# Altium schematic sheet led1.SchDoc
size A4; DocumentNumber: 1; SheetNumber: 1; SheetTotal: 8
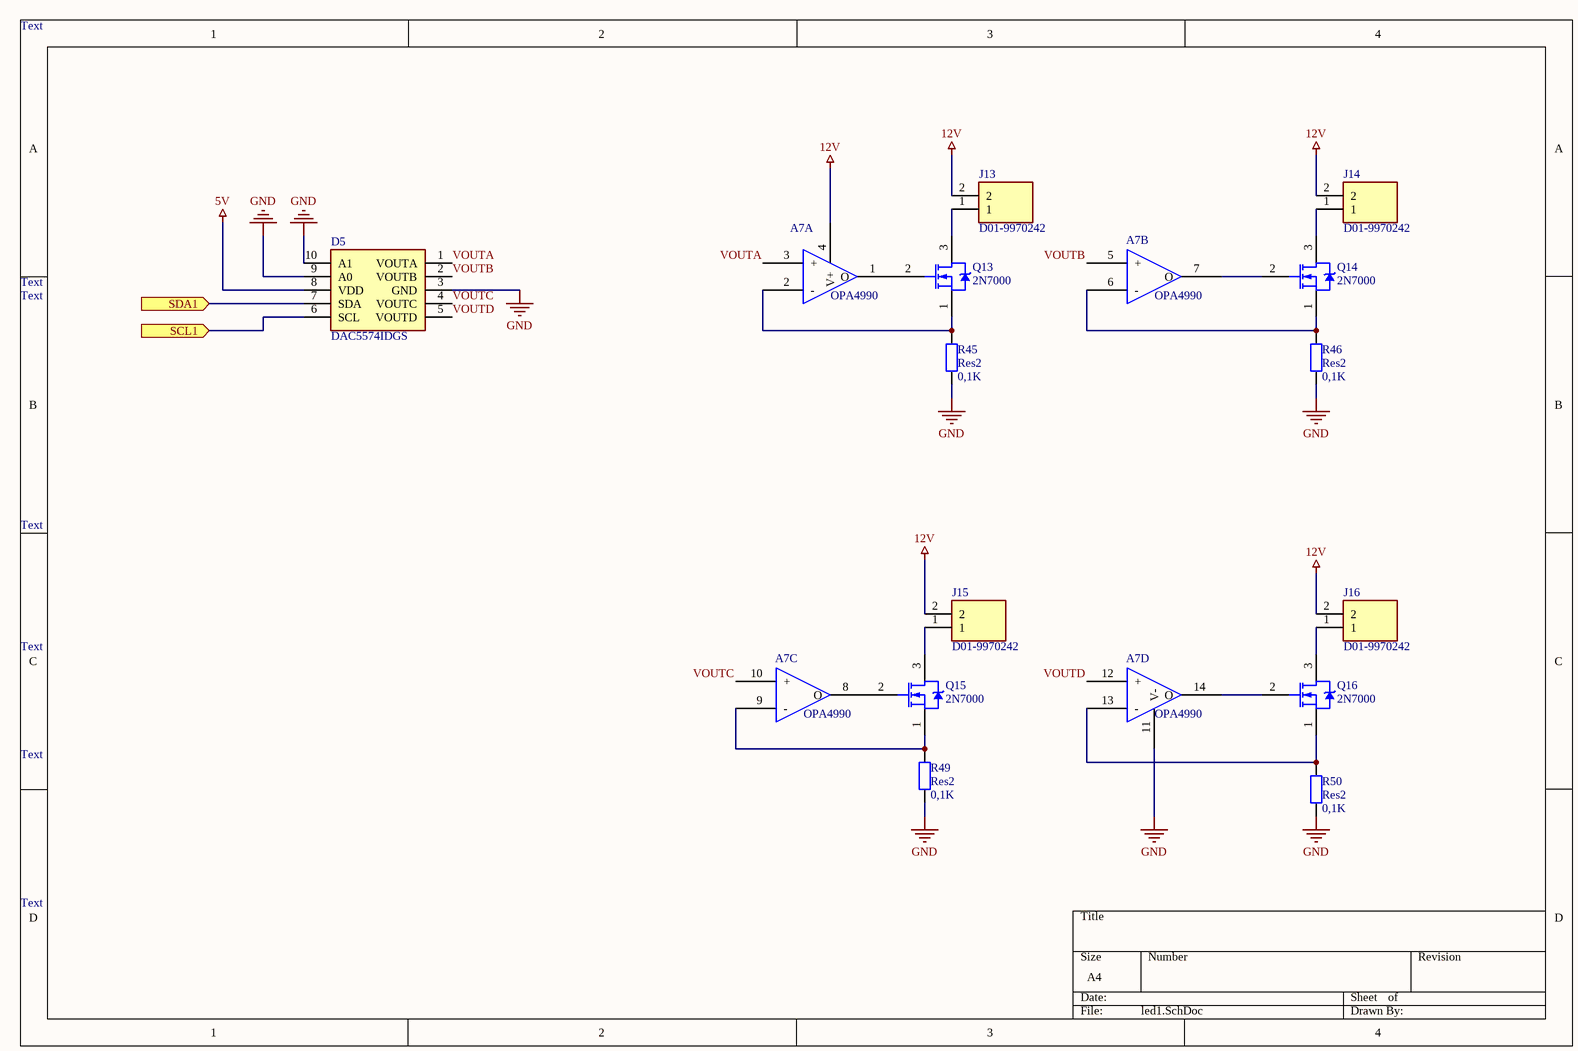
[diagram p0: led1.SchDoc]

## Parts
A7  OPA4990  [SOIC127P600X175-14N]  (parts A,B,C,D of 4)
D5  DAC5574IDGS  [SOP50P490X110-10N]
J13  D01-9970242  [HDR1X2]
J14  D01-9970242  [HDR1X2]
J15  D01-9970242  [HDR1X2]
J16  D01-9970242  [HDR1X2]
Q13  2N7000  [ONSC-TO-92-3-29-11]
Q14  2N7000  [ONSC-TO-92-3-29-11]
Q15  2N7000  [ONSC-TO-92-3-29-11]
Q16  2N7000  [ONSC-TO-92-3-29-11]
R45  Res2  value 0,1K  [C1210]
R46  Res2  value 0,1K  [C1210]
R49  Res2  value 0,1K  [C1210]
R50  Res2  value 0,1K  [C1210]

## Ports
SCL1 (in), SDA1 (in)

## Nets
5V: D5.8(VDD)
12V: A7.4(V+) J13.2 J14.2 J15.2 J16.2
GND: A7.11(V-) D5.3(GND) D5.9(A0) D5.10(A1) R45.1 R46.1 R49.2 R50.2
SCL1: D5.6(SCL) ; port SCL1
SDA1: D5.7(SDA) ; port SDA1
VOUTA: A7.3(+) D5.1(VOUTA)
VOUTB: A7.5(+) D5.2(VOUTB)
VOUTC: A7.10(+) D5.4(VOUTC)
VOUTD: A7.12(+) D5.5(VOUTD)
NetA7_1: A7.1(O) Q13.2(G)
NetA7_2: A7.2(-) Q13.1(S) R45.2
NetA7_6: A7.6(-) Q14.1(S) R46.2
NetA7_7: A7.7(O) Q14.2(G)
NetA7_8: A7.8(O) Q15.2(G)
NetA7_9: A7.9(-) Q15.1(S) R49.1
NetA7_13: A7.13(-) Q16.1(S) R50.1
NetA7_14: A7.14(O) Q16.2(G)
NetJ13_1: J13.1 Q13.3(D)
NetJ14_1: J14.1 Q14.3(D)
NetJ15_1: J15.1 Q15.3(D)
NetJ16_1: J16.1 Q16.3(D)

## Notes on the sheet
- Text

## Library data of the parts
D5 = DAC5574IDGS: Integrated Circuit; Manufacturer_Name: Texas Instruments; Datasheet Link: http://www.ti.com/lit/gpn/dac5574; Height: 1.1mm; Manufacturer_Part_Number: DAC5574IDGS; Mouser Part Number: 595-DAC5574IDGS; Mouser Price/Stock: https://www.mouser.com/Search/Refine.aspx?Keyword=595-DAC5574IDGS; RS Part Number: 6621533P; RS Price/Stock: http://uk.rs-online.com/web/p/products/6621533P
J13-J16 = D01-9970242: Connector; Manufacturer_Name: HARWIN; Datasheet Link: https://componentsearchengine.com/Datasheets/1/D01-9970242.pdf; Height: 4.25mm; Manufacturer_Part_Number: D01-9970242; Mouser Part Number: 855-D01-9970242; Mouser Price/Stock: https://www.mouser.com/Search/Refine.aspx?Keyword=855-D01-9970242
Q13-Q16 = CMP-1058-00936-1: Small Signal MOSFET, 200 mA, 60 V, N-Channel, 3-Pin TO-92, Bulk Box; Manufacturer: On Semiconductor; Ciss Typ (pF): 60; VGS(th) Max (V): 3; Crss Typ (pF): 5; Channel Polarity: N Channel; VGS Max (V): 20; Configuration: Single; PD Max (W): 0.35; Coss Typ (pF): 25; ID Max (A): 0.2; PackageVersion: Rev. AM; ComponentLink3URL: http://www.onsemi.cn/pub_link/Collateral/2N6426-D.PDF; ComponentLink2URL: http://www.onsemi.com/pub_link/Collateral/2N7000-D.PDF; DatasheetVersion: Rev. 8; Mounting Technology: Through Hole; V(BR)DSS Min (V): 60; PartNumber: 2N7000; PackageDescription: 3-Pin Transistor Outline, Body 4.825 x 3.685 mm, Pitch 1.27 mm; ComponentLink2Description: Datasheet; ComponentLink1URL: http://www.onsemi.com/; PackageReference: TO-92-3-29-11_AM_SL; Packing: Bulk Box; ComponentLink1Description: Manufacturer URL; Package Type: TO-92; ComponentLink3Description: Package Specification
R45 R46 R49 R50 = Res2: Resistor; Published: 8-Jun-2000; LatestRevisionDate: 17-Jul-2002; LatestRevisionNote: Re-released for DXP Platform.; PackageReference: AXIAL-0.4; Publisher: Altium Limited; PackageDescription: Axial Device, Thru-Hole; 2 Leads; 0.4 in Pin Spacing